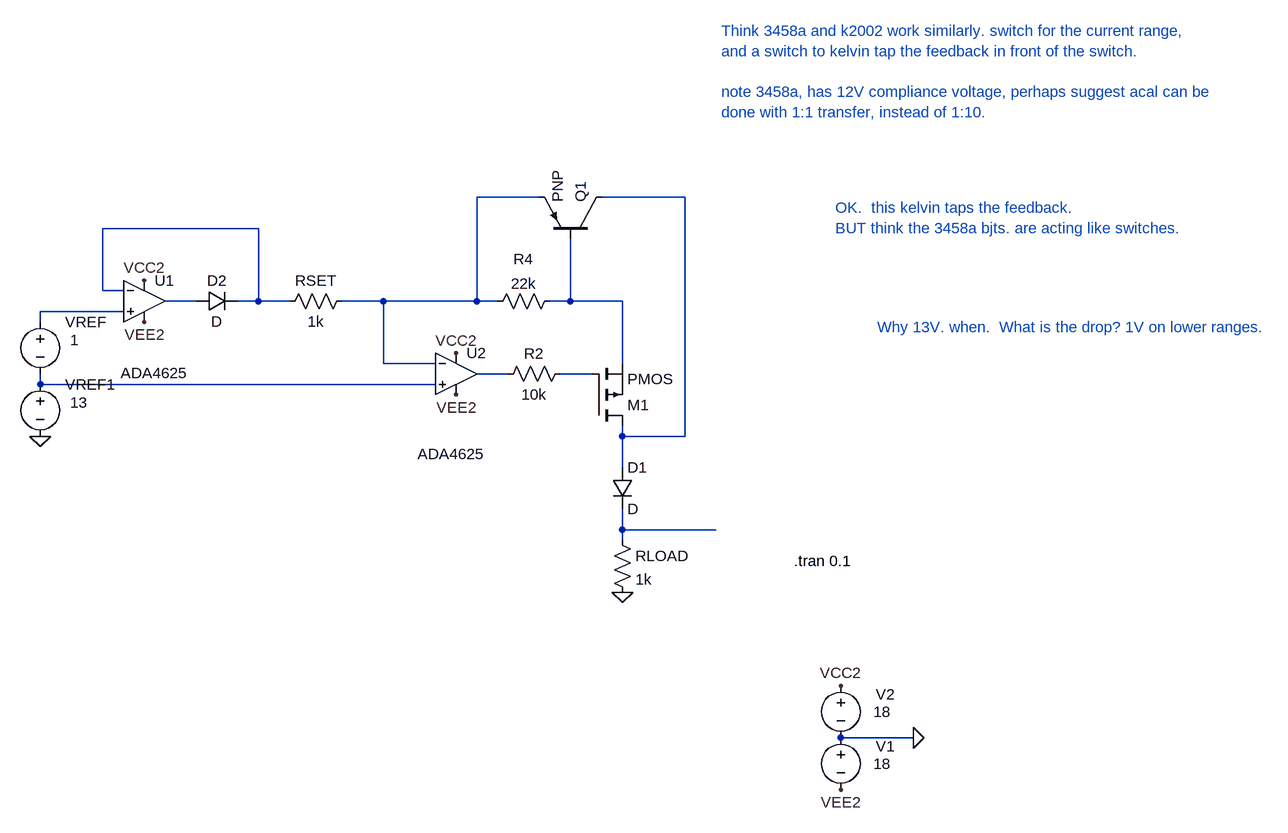
[diagram p0: schematic Draft18.asc]
Draft18.asc, the LTspice schematic file:
Version 4
SHEET 1 1768 872
WIRE 544 -144 448 -144
WIRE 768 -144 640 -144
WIRE 112 -96 -128 -96
WIRE -128 0 -128 -96
WIRE -96 0 -128 0
WIRE 16 16 -32 16
WIRE 112 16 112 -96
WIRE 112 16 80 16
WIRE 160 16 112 16
WIRE 304 16 240 16
WIRE 448 16 448 -144
WIRE 448 16 304 16
WIRE 480 16 448 16
WIRE 592 16 592 -80
WIRE 592 16 560 16
WIRE 672 16 592 16
WIRE -96 32 -224 32
WIRE -224 48 -224 32
WIRE 304 112 304 16
WIRE 384 112 304 112
WIRE 672 112 672 16
WIRE 496 128 448 128
WIRE 624 128 576 128
WIRE -224 144 -224 128
WIRE 384 144 -224 144
WIRE 672 224 672 208
WIRE 768 224 768 -144
WIRE 768 224 672 224
WIRE 672 272 672 224
WIRE 672 368 672 336
WIRE 816 368 672 368
WIRE 672 384 672 368
WIRE 1120 688 1008 688
FLAG 1120 688 0
FLAG 1008 768 VEE2
FLAG 1008 608 VCC2
FLAG 416 160 VEE2
FLAG 416 96 VCC2
FLAG -64 48 VEE2
FLAG -64 -16 VCC2
FLAG -224 224 0
FLAG 672 464 0
SYMBOL voltage 1008 672 R0
WINDOW 0 54 29 Left 2
WINDOW 3 50 56 Left 2
WINDOW 123 0 0 Left 0
WINDOW 39 0 0 Left 0
SYMATTR InstName V1
SYMATTR Value 18
SYMBOL res 656 368 R0
SYMATTR InstName RLOAD
SYMATTR Value 1k
SYMBOL res 256 0 R90
WINDOW 0 0 56 VBottom 2
WINDOW 3 32 56 VTop 2
SYMATTR InstName RSET
SYMATTR Value 1k
SYMBOL pmos 624 208 M180
SYMATTR InstName M1
SYMBOL voltage 1008 592 R0
WINDOW 0 54 29 Left 2
WINDOW 3 50 56 Left 2
WINDOW 123 0 0 Left 0
WINDOW 39 0 0 Left 0
SYMATTR InstName V2
SYMATTR Value 18
SYMBOL res 592 112 R90
WINDOW 0 0 56 VBottom 2
WINDOW 3 32 56 VTop 2
SYMATTR InstName R2
SYMATTR Value 10k
SYMBOL res 576 0 R90
WINDOW 0 -33 56 VBottom 2
WINDOW 3 -27 56 VTop 2
SYMATTR InstName R4
SYMATTR Value 22k
SYMBOL pnp 640 -80 M270
SYMATTR InstName Q1
SYMBOL OpAmps\\ADA4625 416 64 R0
WINDOW 3 -59 187 Left 2
SYMATTR InstName U2
SYMBOL diode 656 272 R0
SYMATTR InstName D1
SYMBOL OpAmps\\ADA4625 -64 -48 R0
WINDOW 3 -36 175 Left 2
SYMATTR InstName U1
SYMBOL voltage -224 32 R0
WINDOW 123 0 0 Left 0
WINDOW 39 0 0 Left 0
WINDOW 3 46 44 Left 2
WINDOW 0 38 16 Left 2
SYMATTR Value 1
SYMATTR InstName VREF
SYMBOL diode 16 32 R270
WINDOW 0 32 32 VTop 2
WINDOW 3 0 32 VBottom 2
SYMATTR InstName D2
SYMBOL voltage -224 128 R0
WINDOW 123 0 0 Left 0
WINDOW 39 0 0 Left 0
WINDOW 3 46 44 Left 2
WINDOW 0 38 16 Left 2
SYMATTR Value 13
SYMATTR InstName VREF1
TEXT 936 416 Left 2 !.tran 0.1
TEXT 1000 -128 Left 2 ;OK.  this kelvin taps the feedback.\nBUT think the 3458a bjts. are acting like switches.
TEXT 824 -400 Left 2 ;Think 3458a and k2002 work similarly. switch for the current range,\nand a switch to kelvin tap the feedback in front of the switch.\n \nnote 3458a, has 12V compliance voltage, perhaps suggest acal can be\ndone with 1:1 transfer, instead of 1:10.
TEXT 1064 56 Left 2 ;Why 13V. when.  What is the drop? 1V on lower ranges.

The netlist it stands for:
* Draft18.asc
V1 0 VEE2 18
RLOAD N010 0 1k
RSET N001 N003 1k
M1 N002 N008 N005 N005 PMOS
V2 VCC2 0 18
R2 N008 N007 10k
R4 N005 N001 22k
Q1 N002 N005 N001 0 PNP
XU2 N009 N001 VCC2 VEE2 N007 ADA4625  ; pins In+ In- V+ V- OUT
D1 N002 N010 D
XU1 N006 N003 VCC2 VEE2 N004 ADA4625  ; pins In+ In- V+ V- OUT
VREF N006 N009 1
D2 N004 N003 D
VREF1 N009 0 13
.model D D
.lib standard.dio
.model NPN NPN
.model PNP PNP
.lib standard.bjt
.model NMOS NMOS
.model PMOS PMOS
.lib standard.mos
.tran 0.1
* OK.  this kelvin taps the feedback.
* BUT think the 3458a bjts. are acting like switches.
* Think 3458a and k2002 work similarly. switch for the current range,
* and a switch to kelvin tap the feedback in front of the switch.
* note 3458a, has 12V compliance voltage, perhaps suggest acal can be
* done with 1:1 transfer, instead of 1:10.
* Why 13V. when.  What is the drop? 1V on lower ranges.
.backanno
.end